# Altium project Med_Prj_ECG.PrjPcb (part 5 of 5)

## Sheet MCU.SchDoc
size A3; SheetNumber: 6; SheetTotal: 12
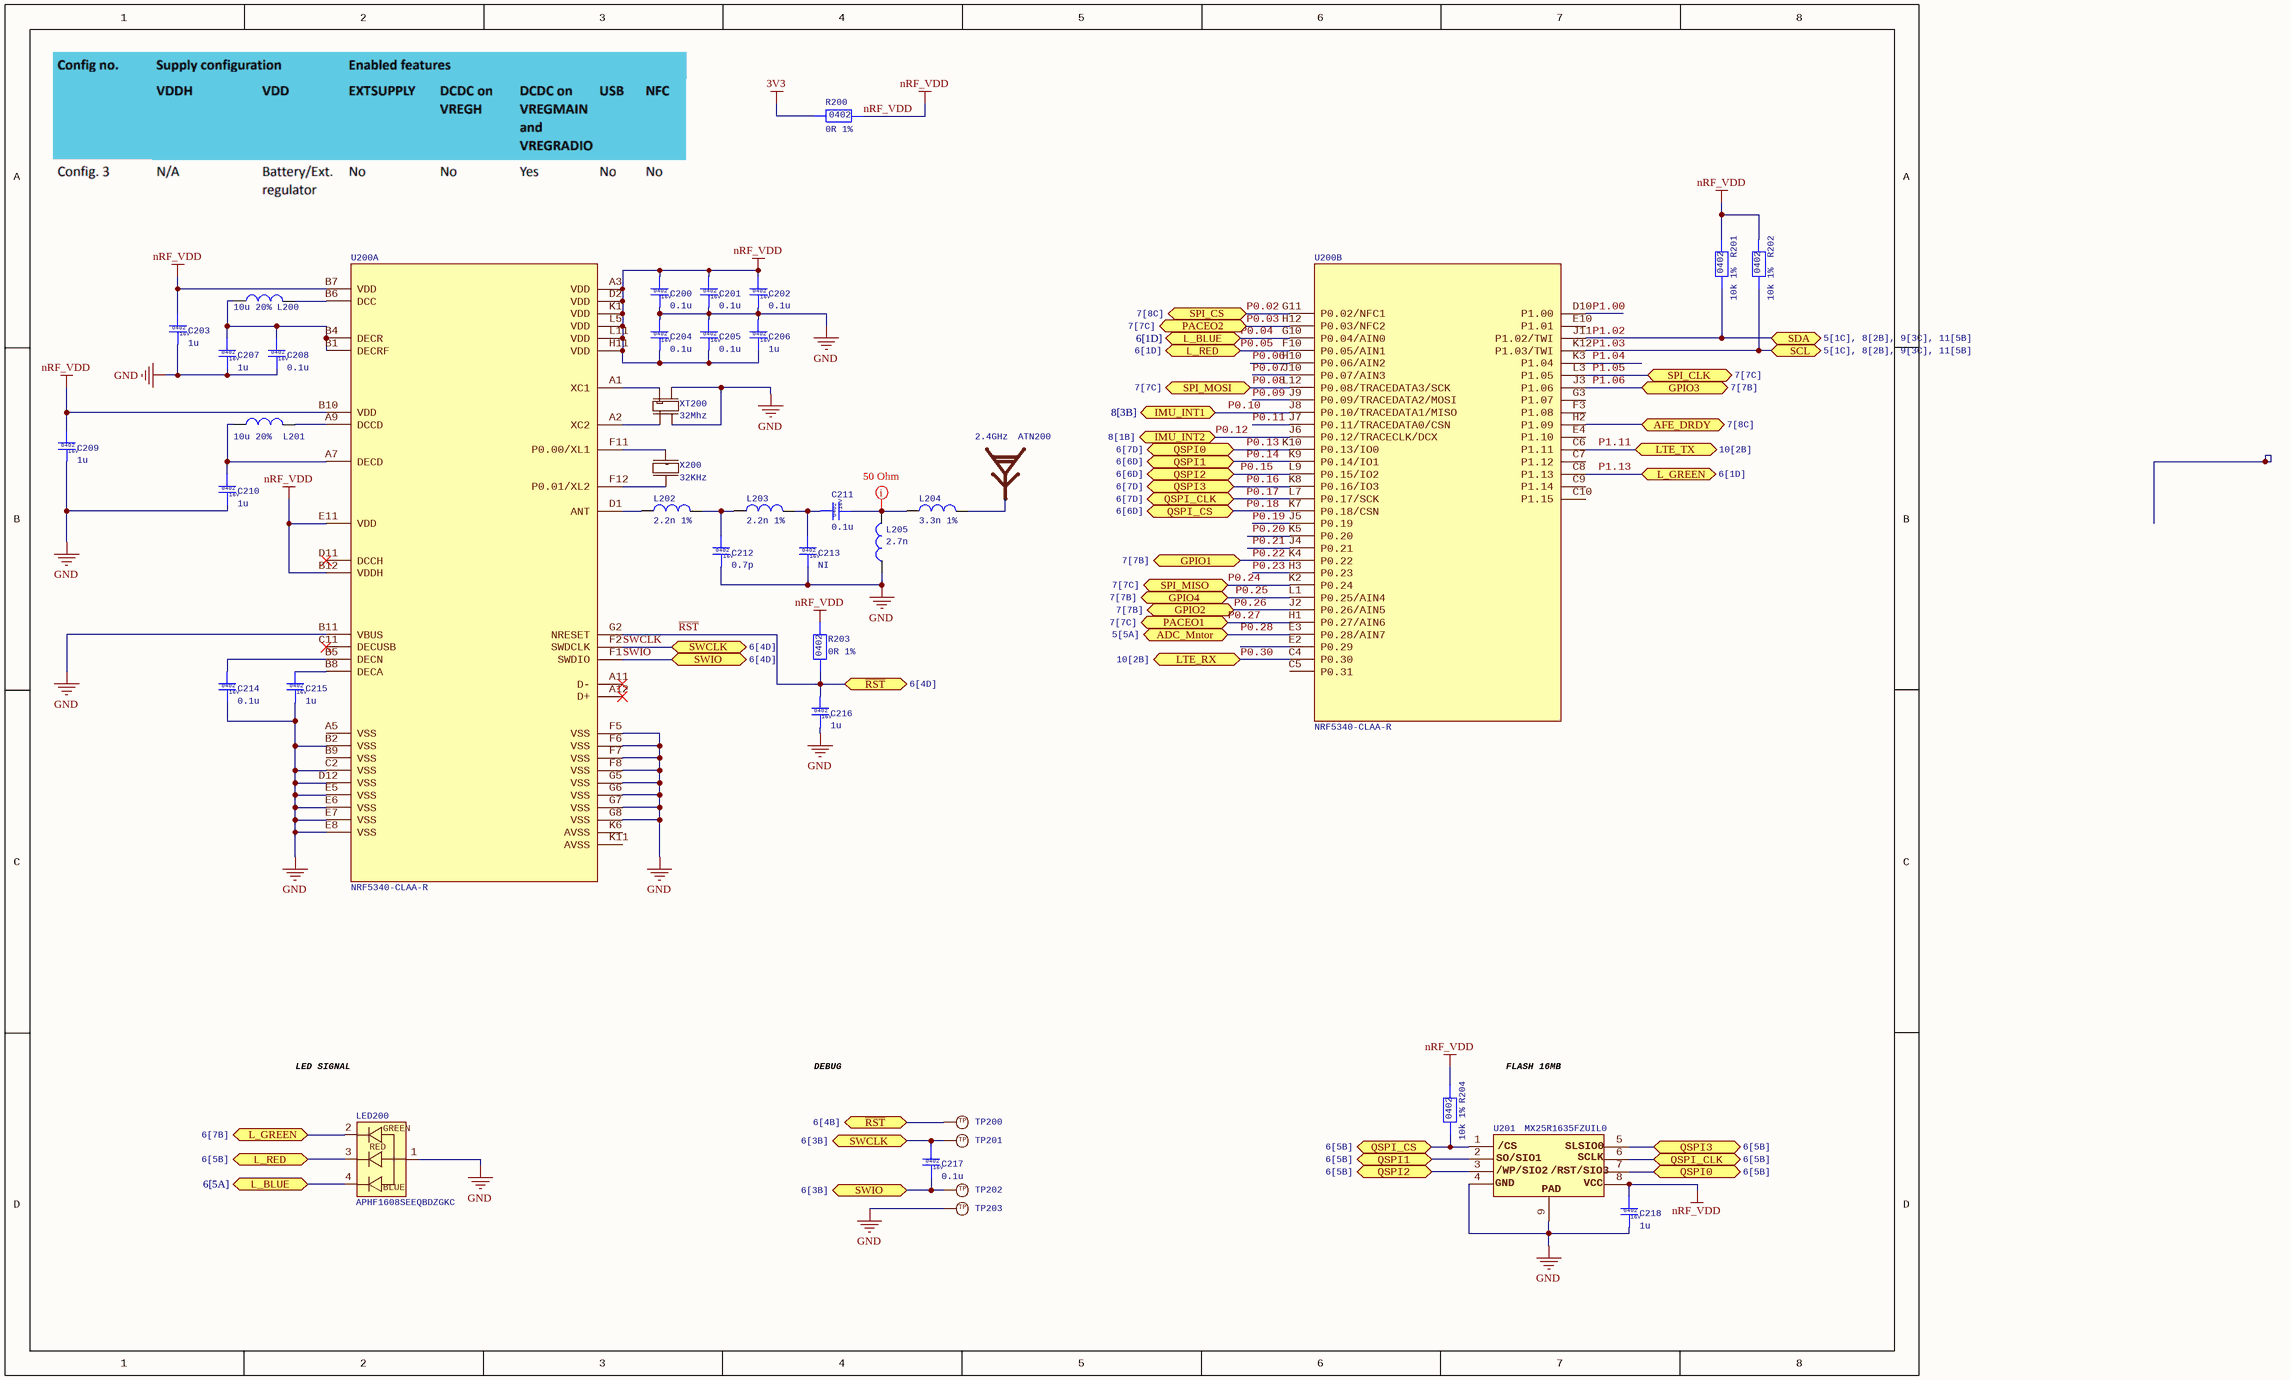
[diagram p8: MCU.SchDoc]

### Parts
ATN200  2.4GHz  [2450AT18B0100001E]
C200  0.1u  [CAP0402]
C201  0.1u  [CAP0402]
C202  0.1u  [CAP0402]
C203  1u  [CAP0402]
C204  0.1u  [CAP0402]
C205  0.1u  [CAP0402]
C206  1u  [CAP0402]
C207  1u  [CAP0402]
C208  0.1u  [CAP0402]
C209  1u  [CAP0402]
C210  1u  [CAP0402]
C211  0.1u  [CAP0402]
C212  0.7p  [CAP0402]
C213  NI  [CAP0402]
C214  0.1u  [CAP0402]
C215  1u  [CAP0402]
C216  1u  [CAP0402]
C217  0.1u  [CAP0402]
C218  1u  [CAP0402]
L200  10u 20%  [MLZ1608N100LTD25]
L201  10u 20%  [MLZ1608N100LTD25]
L202  2.2n 1%  [0402(1005) L]
L203  2.2n 1%  [0402(1005) L]
L204  3.3n 1%  [0402(1005) L]
L205  2.7n  [0402(1005) L]
LED200  APHF1608SEEQBDZGKC  [APHF1608SEEQBDZGKC]
R200  0R 1%  [RES0402]
R201  10k 1%  [R0402]
R202  10k 1%  [R0402]
R203  0R 1%  [RES0402]
R204  10k 1%  [R0402]
TP200  TP  [TP]  (value not drawn)
TP201  TP  [TP]  (value not drawn)
TP202  TP  [TP]  (value not drawn)
TP203  TP  [TP]  (value not drawn)
U200  NRF5340-CLAA-R  [NRF5340-CLAA-R]  (parts A,B of 2)
U201  MX25R1635FZUIL0  [MX25R1635FZUIL0]
X200  32KHz  [32Khz]
XT200  32Mhz  [XRCGB32M000F2P01R0]

### Ports
ADC_Mntor (bidir, see 5[5A]), AFE_DRDY (bidir, see 7[8C]), GPIO1 (bidir, see 7[7B]), GPIO2 (bidir, see 7[7B]), GPIO3 (bidir, see 7[7B]), GPIO4 (bidir, see 7[7B]), IMU_INT1 (bidir, see 8[3B]), IMU_INT2 (bidir, see 8[1B]), L_BLUE (bidir, see 6[1D]), L_BLUE (bidir, see 6[5A]), L_GREEN (bidir, see 6[1D]), L_GREEN (bidir, see 6[7B]), L_RED (bidir, see 6[1D]), L_RED (bidir, see 6[5B]), LTE_RX (bidir, see 10[2B]), LTE_TX (bidir, see 10[2B]), PACEO1 (bidir, see 7[7C]), PACEO2 (bidir, see 7[7C]), QSPI0 (bidir, see 6[5B]), QSPI0 (bidir, see 6[7D]), QSPI1 (bidir, see 6[5B]), QSPI1 (bidir, see 6[6D]), QSPI2 (bidir, see 6[5B]), QSPI2 (bidir, see 6[6D]), QSPI3 (bidir, see 6[5B]), QSPI3 (bidir, see 6[7D]), QSPI_CLK (bidir, see 6[5B]), QSPI_CLK (bidir, see 6[7D]), QSPI_CS (bidir, see 6[5B]), QSPI_CS (bidir, see 6[6D]), SCL (bidir, see 5[1C], 8[2B], 9[3C], 11[5B]), SDA (bidir, see 5[1C], 8[2B], 9[3C], 11[5B]), SPI_CLK (bidir, see 7[7C]), SPI_CS (bidir, see 7[8C]), SPI_MISO (bidir, see 7[7C]), SPI_MOSI (bidir, see 7[7C]), SWCLK (bidir, see 6[3B]), SWCLK (bidir, see 6[4D]), SWIO (bidir, see 6[3B]), SWIO (bidir, see 6[4D]), ~{RST} (bidir, see 6[4B]), ~{RST} (bidir, see 6[4D])

### Nets
3V3: R200.1
GND: C200.2 C201.2 C202.2 C203.2 C204.1 C205.1 C206.1 C207.2 C208.2 C209.2 C210.2 C212.2 C213.2 C214.2 C215.2 C216.2 C218.2 L205.1 LED200.1 TP203.1 U200.B2(VSS) U200.B11(VBUS) U200.C2(VSS) U200.D12(VSS) U200.E5(VSS) U200.E6(VSS) U200.E7(VSS) U200.E8(VSS) U200.F5(VSS) U200.F6(VSS) U200.F7(VSS) U200.F8(VSS) U200.G5(VSS) U200.G6(VSS) U200.G7(VSS) U200.G8(VSS) U201.4 U201.9 XT200.2 XT200.4
nRF_VDD: C200.1 C201.1 C202.1 C203.1 C204.2 C205.2 C206.2 C209.1 C218.1 R200.2 R201.2 R202.2 R203.2 R204.2 U200.A3(VDD) U200.B7(VDD) U200.B10(VDD) U200.B12(VDDH) U200.D2(VDD) U200.E11(VDD) U200.H11(VDD) U200.K1(VDD) U200.L5(VDD) U200.L11(VDD) U201.8
P0.02: U200.G11(P0.02/NFC1) ; port SPI_CS
P0.03: U200.H12(P0.03/NFC2) ; port PACEO2
P0.04: LED200.4 U200.G10(P0.04/AIN0) ; port L_BLUE
P0.05: LED200.3 U200.F10(P0.05/AIN1) ; port L_RED
P0.06: U200.H10(P0.06/AIN2)
P0.07: U200.J10(P0.07/AIN3)
P0.08: U200.L12(P0.08/TRACEDATA3/SCK) ; port SPI_MOSI
P0.09: U200.J9(P0.09/TRACEDATA2/MOSI)
P0.10: U200.J8(P0.10/TRACEDATA1/MISO) ; port IMU_INT1
P0.11: U200.J7(P0.11/TRACEDATA0/CSN)
P0.12: U200.J6(P0.12/TRACECLK/DCX) ; port IMU_INT2
P0.13: U200.K10(P0.13/IO0) U201.7 ; port QSPI0
P0.14: U200.K9(P0.14/IO1) U201.2(SO/SIO1) ; port QSPI1
P0.15: U200.L9(P0.15/IO2) U201.3 ; port QSPI2
P0.16: U200.K8(P0.16/IO3) U201.5 ; port QSPI3
P0.17: U200.L7(P0.17/SCK) U201.6 ; port QSPI_CLK
P0.18: R204.1 U200.K7(P0.18/CSN) U201.1(/CS) ; port QSPI_CS
P0.19: U200.J5(P0.19)
P0.20: U200.K5(P0.20)
P0.21: U200.J4(P0.21)
P0.22: U200.K4(P0.22) ; port GPIO1
P0.23: U200.H3(P0.23)
P0.24: U200.K2(P0.24) ; port SPI_MISO
P0.25: U200.L1(P0.25/AIN4) ; port GPIO4
P0.26: U200.J2(P0.26/AIN5) ; port GPIO2
P0.27: U200.H1(P0.27/AIN6) ; port PACEO1
P0.28: U200.E3(P0.28/AIN7) ; port ADC_Mntor
P0.30: U200.C4(P0.30) ; port LTE_RX  [project net LTE_RX]
P1.00: U200.D10(P1.00)
P1.02: R201.1 U200.J11(P1.02/TWI) ; port SDA
P1.03: R202.1 U200.K12(P1.03/TWI) ; port SCL
P1.04: U200.K3(P1.04)
P1.05: U200.L3(P1.05) ; port SPI_CLK
P1.06: U200.J3(P1.06) ; port GPIO3
P1.11: U200.C6(P1.11) ; port LTE_TX  [project net LTE_TX]
P1.13: LED200.2 U200.C8(P1.13) ; port L_GREEN
~{RST}: C216.1 R203.1 TP200.1 U200.G2(NRESET) ; port ~{RST}
SWCLK: C217.1 TP201.1 U200.F2(SWDCLK) ; port SWCLK
SWIO: C217.2 TP202.1 U200.F1(SWDIO) ; port SWIO
NetATN200_1: ATN200.1 L204.2
NetC207_1: C207.1 C208.1 L200.1 U200.B1(DECRF) U200.B4(DECR)
NetC210_1: C210.1 L201.1 U200.A7(DECD)
NetC211_1: C211.1 C213.1 L203.2
NetC211_2: C211.2 L204.1 L205.2
NetC212_1: C212.1 L202.2 L203.1
NetC214_1: C214.1 U200.B5(DECN)
NetC215_1: C215.1 U200.B8(DECA)
NetL200_2: L200.2 U200.B6(DCC)
NetL201_2: L201.2 U200.A9(DCCD)
NetL202_1: L202.1 U200.D1(ANT)
NetR313_1: U200.H2(P1.09) ; port AFE_DRDY
NetU200_A1: U200.A1(XC1) XT200.1
NetU200_A2: U200.A2(XC2) XT200.3
NetU200_F11: U200.F11(P0.00/XL1) X200.1
NetU200_F12: U200.F12(P0.01/XL2) X200.2

Not connected (* = marked no-connect by the designer): U200 A5(VSS) A11(D-)* A12(D+)* B9(VSS) C5(P0.31) C7(P1.12) C9(P1.14) C10(P1.15) C11(DECUSB)* D11(DCCH)* E2(P0.29) E4(P1.10) E10(P1.01) F3(P1.08) G3(P1.07) K6(AVSS) K11(AVSS)

### Layout directives
mark named 50 Ohm: NetC211_2

### Notes on the sheet
- LED SIGNAL
- DEBUG
- FLASH 16MB
- (in symbol APHF1608SEEQBDZGKC) GREEN; RED; BLUE
- (in symbol C_0402_0.7p) 16V
- (in symbol MX25R1635FZUIL0) SLSIO0; SCLK; /WP/SIO2; /RST/SIO3; GND; VCC; PAD

### Library data of the parts
ATN200 = 2450AT18B0100001E: Rf Ant 2.4GHZ Chip Solder SMD; Manufacturer: Johanson; Supplier 1: Digikey; Supplier Part Number 1: 712-2450AT18B0100001ECT-ND; Supplier: Digikey; Supplier Part Number: 712-2450AT18B0100001ECT-ND; Manufacturer Part Number: 2450AT18B0100001E; RoHS: No; Category: RF Antennas; Stock: 16167; Pricing: 1=1.02, 10=0.637, 25=0.534, 100=0.4175, 250=0.36032, 500=0.32526, 1000=0.29604 (USD)
C200-C202 C204 C205 C208 C211 C213 C214 C217 = C_0402_0.1u: Ceramic Capacitor, Multilayer, Ceramic, 16V, 10% +Tol, 10% -Tol, X7R, 15% TC, 0.1uF, Surface Mount, 0402; Manufacturer: Murata; Manufacturer Part Number: GRM155R71C104KA88J; Value: 100nF; Multilayer: Yes; Supplier: Digikey; Supplier Part Number: 490-6328-1-ND; RoHS: Yes; Category: Ceramic Capacitors; Stock: 19409569; Pricing: 1=0.1, 10=0.019, 50=0.011, 100=0.0086, 500=0.00646, 1000=0.00508, 2500=0.00462, 5000=0.00425 (USD); Mounting Technology: Surface Mount; Pins: 2; Dielectric Material: Ceramic; Package Shape: Rectangular; Case/Package: 0402; Terminal Finish: Nickel; Min Operating Temperature: -55°C; Max Operating Temperature: 125°C; JESD-609 Code: e3; Capacitor Type: Ceramic; Tolerance  (fill in as +-): 10%; Package Style: SMTMeter; Packaging: Tape and Reel; Tolerance (fill in as +-): 10%; Rated DC Voltage (URdc): 16V; Temperature Characteristics Code: X7R; Termination: Wraparound; Length: 1mm; Width: 0.5mm; Height: 0.5mm; Reach SVHC Compliant: Yes; RoHS Compliant: Yes; ComponentLink1URL: https://psearch.en.murata.com:443/capacitor/product/GRM155R71C104KA88%23.pdf?src-supplier=IHS+Markit; ComponentLink1Description: https://psearch.en.murata.com:443/capacitor/product/GRM155R71C104KA88%23.pdf?src-supplier=IHS+Markit; ComponentLink2URL: https://datasheet.ciiva.com/6271/product-6271168.pdf?src-supplier=Digikey; ComponentLink2Description: https://datasheet.ciiva.com/6271/product-6271168.pdf?src-supplier=Digikey; ComponentLink3URL: https://datasheet.ciiva.com/6271/grm155r71c104ka88-01-6271231.pdf?src-supplier=Digikey; ComponentLink3Description: https://datasheet.ciiva.com/6271/grm155r71c104ka88-01-6271231.pdf?src-supplier=Digikey
C203 C206 C207 C209 C210 C215 C216 C218 = C_0402_1u: Ceramic Capacitor, Multilayer, Ceramic, 16V, 10% +Tol, 10% -Tol, X5R, 15% TC, 1uF, Surface Mount, 0402; Manufacturer: Taiyo Yuden; Manufacturer Part Number: EMK105BJ105KV-F; Multilayer: Yes; Supplier: Digikey; Supplier Part Number: 587-2477-1-ND; RoHS: Yes; Category: Ceramic Capacitors; Stock: 2709915; Pricing: 1=0.1, 10=0.045, 50=0.031, 100=0.0266, 500=0.01912, 1000=0.01682, 2500=0.01437, 5000=0.01289 (USD); Mounting Technology: Surface Mount; Pins: 2; Dielectric Material: Ceramic; Package Shape: Rectangular; Case/Package: 0402; Terminal Finish: Nickel; Min Operating Temperature: -55°C; Max Operating Temperature: 85°C; JESD-609 Code: e3; Value: 1uF; Capacitor Type: Ceramic; Tolerance  (fill in as +-): 10%; Package Style: SMTMeter; Packaging: Tape and Reel; Tolerance (fill in as +-): 10%; Rated DC Voltage (URdc): 16V; Temperature Characteristics Code: X5R; Termination: Wraparound; Length: 1mm; Width: 0.5mm; Height: 0.5mm; Reach SVHC Compliant: Yes; RoHS Compliant: Yes; ComponentLink1URL: https://datasheet.ciiva.com:443/pdfs/VipMasterIC/IC/TAIY/TAIY-S-A0009096450/TAIY-S-A0009096597-1.pdf?src-supplier=IHS+Markit; ComponentLink1Description: https://datasheet.ciiva.com:443/pdfs/VipMasterIC/IC/TAIY/TAIY-S-A0009096450/TAIY-S-A0009096597-1.pdf?src-supplier=IHS+Markit; ComponentLink2URL: https://datasheet.ciiva.com/134/emk105bj105kv-f-ss-134209.pdf?src-supplier=Digikey; ComponentLink2Description: https://datasheet.ciiva.com/134/emk105bj105kv-f-ss-134209.pdf?src-supplier=Digikey; ComponentLink3URL: https://datasheet.ciiva.com/15920/964emk105bj105kv-f-15920402.pdf?src-supplier=Onlinecomponents.com; ComponentLink3Description: https://datasheet.ciiva.com/15920/964emk105bj105kv-f-15920402.pdf?src-supplier=Onlinecomponents.com; ComponentLink4URL: https://datasheet.ciiva.com/26871/getdatasheetpartid-638287-26871289.pdf?src-supplier=Verical; ComponentLink4Description: https://datasheet.ciiva.com/26871/getdatasheetpartid-638287-26871289.pdf?src-supplier=Verical; ComponentLink5URL: https://datasheet.ciiva.com/30259/265emk105bj105kv-f-30259872.pdf?src-supplier=Onlinecomponents.com; ComponentLink5Description: https://datasheet.ciiva.com/30259/265emk105bj105kv-f-30259872.pdf?src-supplier=Onlinecomponents.com; ComponentLink6URL: https://datasheet.ciiva.com/7657/1497285-7657320.pdf?src-supplier=Element14; ComponentLink6Description: https://datasheet.ciiva.com/7657/1497285-7657320.pdf?src-supplier=Element14; ComponentLink7URL: https://datasheet.ciiva.com/22694/1497285-22694239.pdf?src-supplier=Element14; ComponentLink7Description: https://datasheet.ciiva.com/22694/1497285-22694239.pdf?src-supplier=Element14; ComponentLink8URL: https://datasheet.ciiva.com/5424/mlcc01-e-5424190.pdf?src-supplier=Mouser; ComponentLink8Description: https://datasheet.ciiva.com/5424/mlcc01-e-5424190.pdf?src-supplier=Mouser
C212 = C_0402_0.7p: Ceramic Capacitor, Multilayer, Ceramic, 50V, 7.14% +Tol, 7.14% -Tol, C0G, 30ppm/Cel TC, 0.0000007uF, Surface Mount, 0402; Manufacturer: Murata; Manufacturer Part Number: GJM1555C1HR70WB01D; Value: 0.7pF; Multilayer: Yes; Supplier: Digikey; Supplier Part Number: 490-11252-1-ND; RoHS: Yes; Category: Ceramic Capacitors; Stock: 178737; Pricing: 1=0.18, 10=0.122, 50=0.073, 100=0.0574, 500=0.04242, 1000=0.03511, 2500=0.03268, 5000=0.0299 (USD); Mounting Technology: Surface Mount; Pins: 2; Dielectric Material: Ceramic; Package Shape: Rectangular; Case/Package: 0402; Terminal Finish: Nickel; Min Operating Temperature: -55°C; Max Operating Temperature: 125°C; JESD-609 Code: e3; Capacitor Type: Ceramic; Tolerance  (fill in as +-): 7.14%; Package Style: SMTMeter; Packaging: Tape and Reel; Tolerance (fill in as +-): 7.14%; Rated DC Voltage (URdc): 50V; Temperature Characteristics Code: C0G; Termination: Wraparound; Length: 1mm; Width: 0.5mm; Height: 0.5mm; Reach SVHC Compliant: Yes; RoHS Compliant: Yes; ComponentLink1URL: https://datasheet.ciiva.com:443/pdfs/VipMasterIC/IC/MURE/MURE-S-A0004378008/MURE-S-A0004383522-1.pdf?src-supplier=IHS+Markit; ComponentLink1Description: https://datasheet.ciiva.com:443/pdfs/VipMasterIC/IC/MURE/MURE-S-A0004378008/MURE-S-A0004383522-1.pdf?src-supplier=IHS+Markit; ComponentLink2URL: https://datasheet.ciiva.com/170/product-170099.pdf?src-supplier=Digikey; ComponentLink2Description: https://datasheet.ciiva.com/170/product-170099.pdf?src-supplier=Digikey; ComponentLink3URL: https://datasheet.ciiva.com/2989/product-2989256.pdf?src-supplier=Avnet; ComponentLink3Description: https://datasheet.ciiva.com/2989/product-2989256.pdf?src-supplier=Avnet
L200 L201 = Inductor 10u: General Purpose Inductor, 10uH, 20%, 1 Element, Ferrite-Core, SMD, 0603; Manufacturer: TDK; Supplier 1: Digikey; Supplier Part Number 1: 445-17067-1-ND; Supplier: Digikey; Supplier Part Number: 445-17067-1-ND; Manufacturer Part Number: MLZ1608N100LTD25; RoHS: Yes; Category: Fixed Inductors; Stock: 21104; Pricing: 1=0.18, 10=0.149, 25=0.1364, 50=0.1206, 100=0.1054, 250=0.10044, 500=0.0944, 1000=0.07231 (USD); Inductor Type: GENERAL PURPOSE INDUCTOR; Reach SVHC Compliant: Yes; RoHS Compliant: Yes; ComponentLink1URL: https://datasheet.ciiva.com:443/pdfs/VipMasterIC/IC/TDKC/TDKC-S-A0007713921/TDKC-S-A0007713921-1.pdf?src-supplier=IHS+Markit; ComponentLink1Description: https://datasheet.ciiva.com:443/pdfs/VipMasterIC/IC/TDKC/TDKC-S-A0007713921/TDKC-S-A0007713921-1.pdf?src-supplier=IHS+Markit; ComponentLink2URL: http://www.mouser.com/ds/2/400/nductor_commercial_decoupling_mlz1608_en-837720.pdf?src-supplier=Mouser; ComponentLink2Description: http://www.mouser.com/ds/2/400/nductor_commercial_decoupling_mlz1608_en-837720.pdf?src-supplier=Mouser; ComponentLink3URL: https://product.tdk.com/info/en/catalog/datasheets/inductor_automotive_decoupling_mlz1608_en.pdf?src-supplier=Digikey; ComponentLink3Description: https://product.tdk.com/info/en/catalog/datasheets/inductor_automotive_decoupling_mlz1608_en.pdf?src-supplier=Digikey; ComponentLink4URL: https://product.tdk.com/info/en/catalog/datasheets/inductor_automotive_decoupling_mlz1608_en.pdf?ref_disty=digikey&src-supplier=Digikey; ComponentLink4Description: https://product.tdk.com/info/en/catalog/datasheets/inductor_automotive_decoupling_mlz1608_en.pdf?ref_disty=digikey&src-supplier=Digikey; ComponentLink5URL: https://datasheet.octopart.com/MLZ1608N100LTD25-TDK-datasheet-66132923.pdf?src-supplier=Future+Electronics; ComponentLink5Description: https://datasheet.octopart.com/MLZ1608N100LTD25-TDK-datasheet-66132923.pdf?src-supplier=Future+Electronics; Value: 10uH
L202 L203 = Inductor 2.2n: General Purpose Inductor, 0.0022uH, 4.545%, 1 Element, SMD, 0402; Manufacturer: Murata; Manufacturer Part Number: LQG15HS2N2B02D; DC Resistance (DCR): 90mR; Inductor Application: RF INDUCTOR; Channels: 1; Quality Factor-Min (at L-nom): 8; Max Current Rating: 900mA; Self Resonant Frequency: 6GHz; Shape/Size Description: RECTANGULAR PACKAGE; Shielding: Unshielded; Test Frequency: 100MHz; Supplier: Digikey; Supplier Part Number: 490-LQG15HS2N2B02DCT-ND; RoHS: Yes; Category: Fixed Inductors; Stock: 10334; Pricing: 1=0.1, 10=0.064, 25=0.058, 50=0.0538, 100=0.0498, 250=0.04508, 500=0.04178, 1000=0.03871, 2500=0.035 (USD); Pins: 2; Terminal Finish: Tin; Min Operating Temperature: -55°C; Max Operating Temperature: 125°C; Tolerance: 4.545%; JESD-609 Code: e3; Inductance-Nom (L): 0.0022uH; Inductor Type: GENERAL PURPOSE INDUCTOR; Surface Mount: Yes; Terminal Placement: Dual Ended; Termination: Wraparound; Reach SVHC Compliant: Yes; RoHS Compliant: Yes; ComponentLink1URL: https://psearch.en.murata.com:443/inductor/product/LQG15HS2N2B02_.pdf?src-supplier=IHS+Markit; ComponentLink1Description: https://psearch.en.murata.com:443/inductor/product/LQG15HS2N2B02_.pdf?src-supplier=IHS+Markit
L204 = Inductor 3.3n: General Purpose Inductor, 0.0033uH, 9.091%, 1 Element, Air-Core, SMD, 0402; Manufacturer: Murata; Manufacturer Part Number: LQG15HS3N3S02D; Core Material: Air; Case/Size Code: 0402; DC Resistance (DCR): 125mR; Inductor Application: RF INDUCTOR; Channels: 1; Quality Factor-Min (at L-nom): 8; Max Current Rating: 800mA; Self Resonant Frequency: 6GHz; Shape/Size Description: RECTANGULAR PACKAGE; Shielding: Unshielded; Test Frequency: 100MHz; Package Height: 0.5mm; Package Length: 1mm; Supplier: Digikey; Supplier Part Number: 490-2616-1-ND; RoHS: Yes; Category: Fixed Inductors; Stock: 49001; Pricing: 1=0.1, 10=0.046, 25=0.042, 50=0.0388, 100=0.036, 250=0.03256, 500=0.03016, 1000=0.02795, 2500=0.02528 (USD); Pins: 2; Terminal Finish: Nickel; Min Operating Temperature: -55°C; Max Operating Temperature: 125°C; Tolerance: 9.091%; JESD-609 Code: e3; Construction: Multilayer Chip; Inductance-Nom (L): 0.0033uH; Inductor Type: GENERAL PURPOSE INDUCTOR; Package Style: SMTMeter; Packaging: Tape and Reel; Surface Mount: Yes; Terminal Placement: Dual Ended; Termination: Wraparound; Package Width: 0.5mm; Reach SVHC Compliant: Yes; RoHS Compliant: Yes; ComponentLink1URL: https://datasheet.ciiva.com:443/pdfs/VipMasterIC/IC/MURE/MURE-S-A0004278247/MURE-S-A0004278708-1.pdf?src-supplier=IHS+Markit; ComponentLink1Description: https://datasheet.ciiva.com:443/pdfs/VipMasterIC/IC/MURE/MURE-S-A0004278247/MURE-S-A0004278708-1.pdf?src-supplier=IHS+Markit; ComponentLink2URL: https://datasheet.ciiva.com/11799/0900766b8090d685-11799072.pdf?src-supplier=Rs; ComponentLink2Description: https://datasheet.ciiva.com/11799/0900766b8090d685-11799072.pdf?src-supplier=Rs; ComponentLink3URL: https://datasheet.ciiva.com/1038/l0075s0083lqg15hs-1038143.pdf?src-supplier=Digikey; ComponentLink3Description: https://datasheet.ciiva.com/1038/l0075s0083lqg15hs-1038143.pdf?src-supplier=Digikey; ComponentLink4URL: https://datasheet.ciiva.com/1038/l0075s0083lqg15hs-1038142.pdf?src-supplier=Digikey; ComponentLink4Description: https://datasheet.ciiva.com/1038/l0075s0083lqg15hs-1038142.pdf?src-supplier=Digikey; ComponentLink5URL: https://datasheet.ciiva.com/4976/o05e-4976661.pdf?src-supplier=Mouser; ComponentLink5Description: https://datasheet.ciiva.com/4976/o05e-4976661.pdf?src-supplier=Mouser; ComponentLink6URL: https://datasheet.ciiva.com/26821/getdatasheetpartid-200403-26821446.pdf?src-supplier=Verical; ComponentLink6Description: https://datasheet.ciiva.com/26821/getdatasheetpartid-200403-26821446.pdf?src-supplier=Verical; ComponentLink7URL: https://datasheet.ciiva.com/1038/l0075s0083lqg15hs-1038144.pdf?src-supplier=Digikey; ComponentLink7Description: https://datasheet.ciiva.com/1038/l0075s0083lqg15hs-1038144.pdf?src-supplier=Digikey
L205 = Inductor 2.7n: General Purpose Inductor, 0.0027uH, 11.111%, 1 Element, Air-Core, SMD, 0402; Manufacturer: Murata; Manufacturer Part Number: LQG15HS2N7S02D; Core Material: Air; Case/Size Code: 0402; DC Resistance (DCR): 120mR; Inductor Application: RF INDUCTOR; Channels: 1; Quality Factor-Min (at L-nom): 8; Max Current Rating: 800mA; Self Resonant Frequency: 6GHz; Shape/Size Description: RECTANGULAR PACKAGE; Shielding: Unshielded; Test Frequency: 100MHz; Package Height: 0.5mm; Package Length: 1mm; Supplier: Digikey; Supplier Part Number: 490-2615-1-ND; RoHS: Yes; Category: Fixed Inductors; Stock: 90500; Pricing: 1=0.1, 10=0.045, 25=0.0408, 50=0.0362, 100=0.0316, 250=0.03012, 500=0.02832, 1000=0.02169, 2500=0.02049 (USD); Pins: 2; Terminal Finish: Nickel; Min Operating Temperature: -55°C; Max Operating Temperature: 125°C; Tolerance: 11.111%; JESD-609 Code: e3; Termination: Wraparound; Construction: Multilayer Chip; Inductance-Nom (L): 0.0027uH; Inductor Type: GENERAL PURPOSE INDUCTOR; Package Style: SMTMeter; Packaging: Tape and Reel; Surface Mount: Yes; Terminal Placement: Dual Ended; Package Width: 0.5mm; RoHS Compliant: Yes; Reach SVHC Compliant: Yes; ComponentLink1URL: https://datasheet.ciiva.com:443/pdfs/VipMasterIC/IC/MURE/MURE-S-A0004224658/MURE-S-A0004278201-1.pdf?src-supplier=IHS+Markit; ComponentLink1Description: https://datasheet.ciiva.com:443/pdfs/VipMasterIC/IC/MURE/MURE-S-A0004224658/MURE-S-A0004278201-1.pdf?src-supplier=IHS+Markit; ComponentLink2URL: https://datasheet.ciiva.com/11801/0900766b8090d685-11801391.pdf?src-supplier=Rs; ComponentLink2Description: https://datasheet.ciiva.com/11801/0900766b8090d685-11801391.pdf?src-supplier=Rs; ComponentLink3URL: https://datasheet.ciiva.com/1038/l0075s0083lqg15hs-1038151.pdf?src-supplier=Digikey; ComponentLink3Description: https://datasheet.ciiva.com/1038/l0075s0083lqg15hs-1038151.pdf?src-supplier=Digikey; ComponentLink4URL: https://datasheet.ciiva.com/1038/l0075s0083lqg15hs-1038153.pdf?src-supplier=Digikey; ComponentLink4Description: https://datasheet.ciiva.com/1038/l0075s0083lqg15hs-1038153.pdf?src-supplier=Digikey; ComponentLink5URL: https://datasheet.ciiva.com/1038/l0075s0083lqg15hs-1038152.pdf?src-supplier=Digikey; ComponentLink5Description: https://datasheet.ciiva.com/1038/l0075s0083lqg15hs-1038152.pdf?src-supplier=Digikey
LED200 = APHF1608SEEQBDZGKC: Triple Color LED, Hyper Red/green/blue, Water Clear, 1.6mm; Manufacturer: Kingbright; Supplier 1: Digikey; Supplier Part Number 1: 754-2144-1-ND; Supplier 2: Digikey; Supplier Part Number 2: 754-2144-2-ND; Supplier: Mouser; Supplier Part Number: 604-APHF1608QBDZGKC; Manufacturer Part Number: APHF1608SEEQBDZGKC; RoHS: Yes; Category: LEDs; Stock: 1314; Pricing: 1=0.68, 10=0.444, 50=0.444, 100=0.291, 1000=0.221, 10000=0.209 (USD); Optoelectronic Device Type: TRIPLE COLOR LED; Reach SVHC Compliant: Yes; RoHS Compliant: Yes; ComponentLink1URL: https://datasheet.ciiva.com:443/pdfs/VipMasterIC/IC/KBEC/KBEC-S-A0008947180/KBEC-S-A0008953389-1.pdf?src-supplier=IHS+Markit; ComponentLink1Description: https://datasheet.ciiva.com:443/pdfs/VipMasterIC/IC/KBEC/KBEC-S-A0008947180/KBEC-S-A0008953389-1.pdf?src-supplier=IHS+Markit; ComponentLink2URL: http://www.kingbrightusa.com/images/catalog/SPEC/APHF1608SEEQBDZGKC.pdf?src-supplier=Digikey; ComponentLink2Description: http://www.kingbrightusa.com/images/catalog/SPEC/APHF1608SEEQBDZGKC.pdf?src-supplier=Digikey
R200 R203 = R_0402_0R: Metal Glaze/thick Film, 0.0625W, 0ohm, Surface Mount, 0402; Manufacturer: Yageo; Manufacturer Part Number: RC0402JR-070RL; Power: 62.5mW; Rated Temperature: 70°C; Package Height: 0.35mm; Package Length: 1mm; Package Width: 0.5mm; Supplier 1: Digikey; Supplier Part Number 1: 311-0.0JRTR-ND; Supplier: Digikey; Supplier Part Number: 311-0.0JRCT-ND; RoHS: Yes; Category: Chip SMD Resistors; Stock: 14877447; Pricing: 1=0.1, 10=0.011, 25=0.0084, 50=0.0064, 100=0.0045, 250=0.00364, 500=0.0029, 1000=0.00214, 5000=0.00154, 10000=0.00133, 30000=0.00117, 50000=0.00107, 100000=0.00105 (USD); Mounting Technology: Surface Mount; Pins: 2; Package Shape: Rectangular; Case/Package: 0402; Terminal Finish: Nickel; Min Operating Temperature: -55°C; Max Operating Temperature: 155°C; JESD-609 Code: e3; Resistor Type: FIXED RESISTOR; Packaging: Tape and Reel; Value: 0R; Technology: METAL GLAZE/THICK FILM; Termination: Wraparound; Construction: Chip; Package Style: SMTMeter; Reach SVHC Compliant: Yes; RoHS Compliant: Yes; ComponentLink1URL: https://datasheet.ciiva.com:443/pdfs/VipMasterIC/IC/YAGO/YAGO-S-A0008145938/YAGO-S-A0008145938-1.pdf?src-supplier=IHS+Markit; ComponentLink1Description: https://datasheet.ciiva.com:443/pdfs/VipMasterIC/IC/YAGO/YAGO-S-A0008145938/YAGO-S-A0008145938-1.pdf?src-supplier=IHS+Markit; ComponentLink2URL: https://datasheet.ciiva.com/2452/pyu-rc0402-51-rohs-l-6-2452608.pdf?src-supplier=Digikey; ComponentLink2Description: https://datasheet.ciiva.com/2452/pyu-rc0402-51-rohs-l-6-2452608.pdf?src-supplier=Digikey; ComponentLink3URL: https://datasheet.ciiva.com/11808/0900766b80c66297-11808195.pdf?src-supplier=Rs; ComponentLink3Description: https://datasheet.ciiva.com/11808/0900766b80c66297-11808195.pdf?src-supplier=Rs; ComponentLink4URL: https://datasheet.ciiva.com/7983/1018594-7983535.pdf?src-supplier=Element14; ComponentLink4Description: https://datasheet.ciiva.com/7983/1018594-7983535.pdf?src-supplier=Element14; ComponentLink5URL: https://datasheet.ciiva.com/22747/1018594-22747515.pdf?src-supplier=Element14; ComponentLink5Description: https://datasheet.ciiva.com/22747/1018594-22747515.pdf?src-supplier=Element14; ComponentLink6URL: https://datasheet.ciiva.com/2452/pyu-r-int-thick-7-2452609.pdf?src-supplier=Digikey; ComponentLink6Description: https://datasheet.ciiva.com/2452/pyu-r-int-thick-7-2452609.pdf?src-supplier=Digikey; ComponentLink7URL: https://datasheet.ciiva.com/2452/pyu-r-int-thick-7-2452610.pdf?src-supplier=Digikey; ComponentLink7Description: https://datasheet.ciiva.com/2452/pyu-r-int-thick-7-2452610.pdf?src-supplier=Digikey; ComponentLink8URL: https://datasheet.ciiva.com/8896/pyu-rc0402-51-rohs-l-6-8896201.pdf?src-supplier=Avnet; ComponentLink8Description: https://datasheet.ciiva.com/8896/pyu-rc0402-51-rohs-l-6-8896201.pdf?src-supplier=Avnet
R201 R202 R204 = R_0402_10k: Fixed Resistor, Metal Glaze/thick Film, 0.06W, 10000ohm, 50V, 1% +/-Tol, 100ppm/Cel, Surface Mount, 0402; Manufacturer: Samsung; Manufacturer Part Number: RC1005F103CS; Power: 60mW; Value: 10kR; Temperature Coefficient: 100ppm/°C; Package Height: 0.35mm; Package Length: 1mm; Package Width: 0.5mm; Supplier: Digikey; Supplier Part Number: 1276-3431-1-ND; RoHS: Yes; Category: Chip SMD Resistors; Stock: 14343795; Pricing: 1=0.1, 10=0.024, 50=0.0156, 100=0.0132, 500=0.00922, 1000=0.00803, 5000=0.00598, 10000=0.00533, 20000=0.00481, 30000=0.00458 (USD); Mounting Technology: Surface Mount; Pins: 2; Package Shape: Rectangular; Case/Package: 0402; Terminal Finish: Nickel; Min Operating Temperature: -55°C; Max Operating Temperature: 125°C; Tolerance: 1%; JESD-609 Code: e3; Resistor Type: FIXED RESISTOR; Construction: Chip; Package Style: SMTMeter; Packaging: Tape and Reel; Technology: METAL GLAZE/THICK FILM; Working Voltage: 50V; Reach SVHC Compliant: Yes; RoHS Compliant: Yes; ComponentLink1URL: https://datasheet.ciiva.com:443/pdfs/VipMasterIC/IC/SEMS/SEMS-S-A0001326806/SEMS-S-A0001326806-1.pdf?src-supplier=IHS+Markit; ComponentLink1Description: https://datasheet.ciiva.com:443/pdfs/VipMasterIC/IC/SEMS/SEMS-S-A0001326806/SEMS-S-A0001326806-1.pdf?src-supplier=IHS+Markit; ComponentLink2URL: https://datasheet.ciiva.com/15196/getdatasheetpartid-504789-15196214.pdf?src-supplier=Verical; ComponentLink2Description: https://datasheet.ciiva.com/15196/getdatasheetpartid-504789-15196214.pdf?src-supplier=Verical; ComponentLink3URL: https://datasheet.ciiva.com/16481/rcseries-16481007.pdf?src-supplier=Future+Electronics; ComponentLink3Description: https://datasheet.ciiva.com/16481/rcseries-16481007.pdf?src-supplier=Future+Electronics
TP200-TP203 = TP: Test Point
U200 = NRF5340-CLAA-R: IC RF TXRX+MCU 802.15.4 95WLCSP; Manufacturer: Nordic Semiconductor; Supplier 1: Digikey; Supplier Part Number 1: 4823-NRF5340-CLAA-RCT-ND; Supplier: Digikey; Supplier Part Number: 4823-NRF5340-CLAA-RCT-ND; Manufacturer Part Number: NRF5340-CLAA-R; RoHS: No; Category: RF Receivers, Transceivers; Stock: 15499; Pricing: 1=7.28, 100=6.2, 500=5.39004, 1000=4.93002 (USD)
U201 = MX25R1635FZUIL0: Flash, 4MX4, PDSO8; Manufacturer: Macronix; Package Body Material: Plastic; Channels: 1; Alternate Memory Width: 2; Clock Frequency: 80MHz; Density: 16777216b; Memory Width: 4; Memory Size: 4194304; Number of Words Code: 4M; Operating Mode: SYNCHRONOUS; Parallel/Serial: SERIAL; Programming Voltage: 3V; Max Supply Voltage: 3.6V; Min Supply Voltage: 1.65V; Nominal Supply Voltage: 1.8V; Supplier 1: Digikey; Supplier Part Number 1: 1092-1204-1-ND; Supplier: Digikey; Supplier Part Number: 1092-1204-1-ND; Manufacturer Part Number: MX25R1635FZUIL0; RoHS: Yes; Category: Memory; Stock: 57667; Pricing: 1=0.97, 10=0.858, 25=0.8184, 50=0.7898, 100=0.7621, 250=0.72684, 500=0.70126, 1000=0.67654, 5000=0.62231, 12000=0.59458 (USD); Case/Package: HVSON; Pins: 8; Package Shape: Rectangular; Min Operating Temperature: -40°C; Max Operating Temperature: 85°C; Memory Format: FLASH; JESD-30 Code: R-PDSO-N8; Organization: 4MX4; Package Style: SMALL OUTLINE, HEAT SINK/SLUG, VERY THIN PROFILEMeter; Surface Mount: Yes; Technology: CMOS; Terminal Form: No Lead; Terminal Position: DUAL; Length: 3mm; Width: 2mm; Terminal Pitch: 0.5mm; Height - Seated (Max): 0.6mm; RoHS Compliant: Yes; Reach SVHC Compliant: Yes; Temperature Grade: INDUSTRIAL; ComponentLink1URL: https://datasheet.ciiva.com:443/pdfs/VipMasterIC/IC/MXMA/MXMA-S-A0007136734/MXMA-S-A0007136734-1.pdf?src-supplier=IHS+Markit; ComponentLink1Description: https://datasheet.ciiva.com:443/pdfs/VipMasterIC/IC/MXMA/MXMA-S-A0007136734/MXMA-S-A0007136734-1.pdf?src-supplier=IHS+Markit; ComponentLink2URL: http://ckassoc.com/oldsite/pdf/Macronix_Product_Line_Card_July_2017_General%20_070617.pdf?src-supplier=Digikey; ComponentLink2Description: http://ckassoc.com/oldsite/pdf/Macronix_Product_Line_Card_July_2017_General%20_070617.pdf?src-supplier=Digikey; ComponentLink3URL: https://datasheet.octopart.com/MX25R1635FZUIL0-Macronix-datasheet-74389714.pdf?src-supplier=SHENGYU+ELECTRONICS; ComponentLink3Description: https://datasheet.octopart.com/MX25R1635FZUIL0-Macronix-datasheet-74389714.pdf?src-supplier=SHENGYU+ELECTRONICS
X200 = CM8V-T1A-32.768KHZ-12.5PF-20PPM-TA-QA: CRYSTAL 32.7680KHZ 12.5PF SMD; Manufacturer: Micro Crystal; Supplier: Digikey; Supplier Part Number: 2195-CM8V-T1A-32.768KHZ-12.5PF-20PPM-TA-QACT-ND; Manufacturer Part Number: CM8V-T1A-32.768KHZ-12.5PF-20PPM-TA-QA; RoHS: No; Category: LDO; Stock: 22759; Pricing: 1=0.43, 10=0.366, 50=0.33, 100=0.3156, 500=0.28466 (USD); Supplier 1: Digikey; Supplier Part Number 1: 2195-CM8V-T1A-32.768KHZ-12.5PF-20PPM-TA-QACT-ND
XT200 = XRCGB32M000F2P01R0: Parallel - Fundamental Quartz Crystal, 32MHz Nom; Manufacturer: Murata; Supplier 1: Digikey; Supplier Part Number 1: 490-18340-1-ND; Supplier: Digikey; Supplier Part Number: 490-18340-1-ND; Manufacturer Part Number: XRCGB32M000F2P01R0; RoHS: Yes; Category: Crystals; Stock: 3681354; Pricing: 1=0.23, 10=0.189, 50=0.1696, 100=0.1508, 500=0.14326, 1000=0.13275 (USD); Crystal/Resonator Type: PARALLEL - FUNDAMENTAL; Reach SVHC Compliant: Yes; RoHS Compliant: Yes; ComponentLink1URL: https://datasheet.ciiva.com:443/pdfs/VipMasterIC/IC/MURE/MURE-S-A0006740795/MURE-S-A0006740847-1.pdf?src-supplier=IHS+Markit; ComponentLink1Description: https://datasheet.ciiva.com:443/pdfs/VipMasterIC/IC/MURE/MURE-S-A0006740795/MURE-S-A0006740847-1.pdf?src-supplier=IHS+Markit

## Sheet POWER_TREE.SchDoc
size A4; SheetNumber: 4; SheetTotal: 12
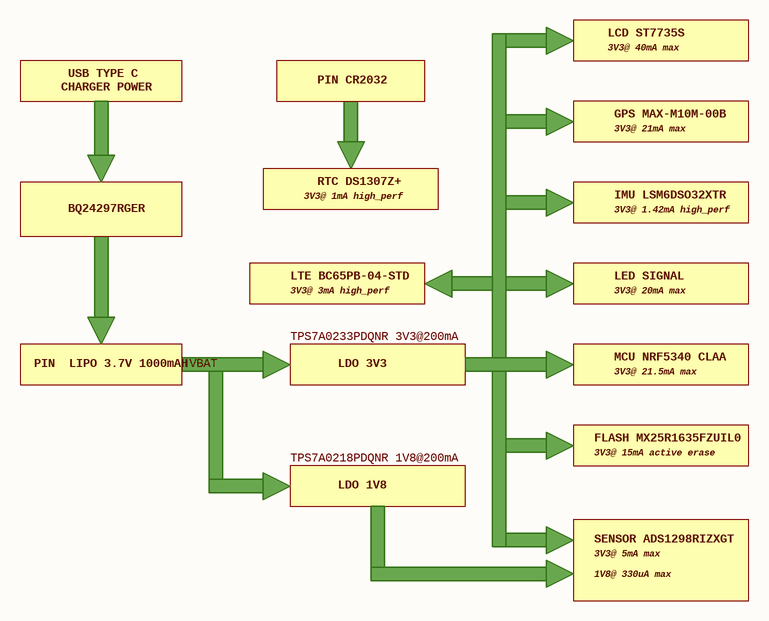
[diagram p9: POWER_TREE.SchDoc]

### Notes on the sheet
- LCD ST7735S
- 3V3@ 40mA max
- CHARGER POWER
- USB TYPE C
- PIN CR2032
- RTC DS1307Z+
- GPS MAX-M10M-00B
- 3V3@ 21mA max
- BQ24297RGER
- 3V3@ 1mA high_perf
- IMU LSM6DSO32XTR
- 3V3@ 1.42mA high_perf
- LTE BC65PB-04-STD
- 3V3@ 3mA high_perf
- LED SIGNAL
- 3V3@ 20mA max
- PIN  LIPO 3.7V 1000mAH
- VBAT
- TPS7A0233PDQNR 3V3@200mA
- LDO 3V3
- MCU NRF5340 CLAA
- 3V3@ 21.5mA max
- FLASH MX25R1635FZUIL0
- 3V3@ 15mA active erase
- TPS7A0218PDQNR 1V8@200mA
- LDO 1V8
- SENSOR ADS1298RIZXGT
- 3V3@ 5mA max
- 1V8@ 330uA max

## Sheet GSM.SchDoc
size A; SheetNumber: 10; SheetTotal: 12
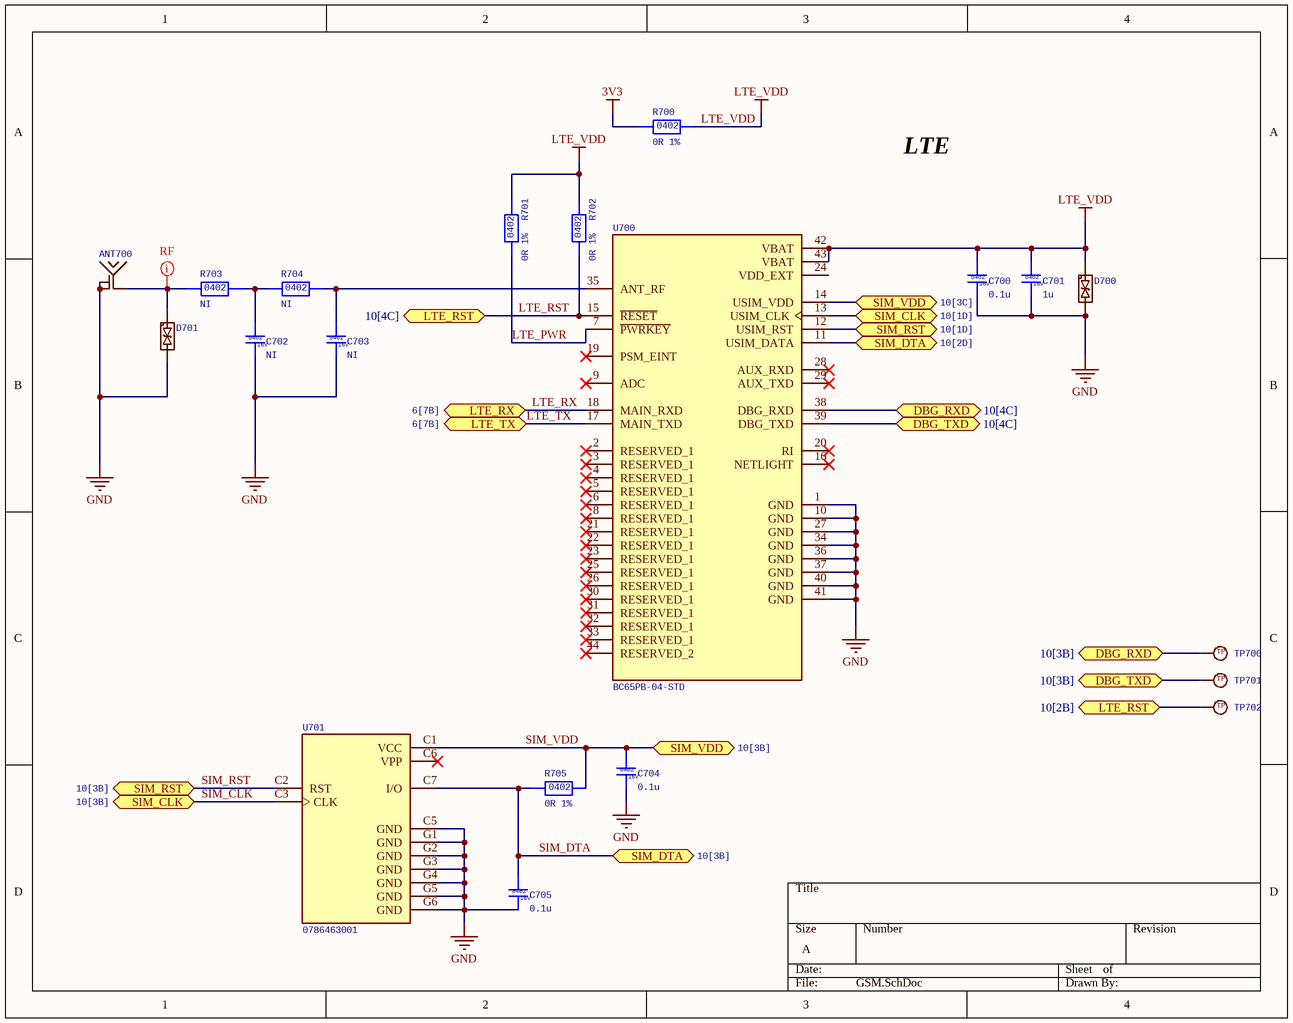
[diagram p10: GSM.SchDoc]

### Parts
ANT700  2337019-1  [2337019-1]  (value not drawn)
C700  0.1u  [CAP0402]
C701  1u  [CAP0402]
C702  NI  [CAP0402]
C703  NI  [CAP0402]
C704  0.1u  [CAP0402]
C705  0.1u  [CAP0402]
D700  DESD3V3S1BL-7B  [DESD3V3S1BL-7B]  (value not drawn)
D701  DESD3V3S1BL-7B  [DESD3V3S1BL-7B]  (value not drawn)
R700  0R 1%  [RES0402]
R701  0R 1%  [RES0402]
R702  0R 1%  [RES0402]
R703  NI  [RES0402]
R704  NI  [RES0402]
R705  0R 1%  [RES0402]
TP700  TP  [TP]  (value not drawn)
TP701  TP  [TP]  (value not drawn)
TP702  TP  [TP]  (value not drawn)
U700  BC65PB-04-STD  [BC65PB-04-STD]
U701  0786463001  [0786463001]

### Ports
DBG_RXD (bidir, see 10[3B]), DBG_RXD (bidir, see 10[4C]), DBG_TXD (bidir, see 10[3B]), DBG_TXD (bidir, see 10[4C]), LTE_RST (bidir, see 10[2B]), LTE_RST (bidir, see 10[4C]), LTE_RX (bidir, see 6[7B]), LTE_TX (bidir, see 6[7B]), SIM_CLK (bidir, see 10[1D]), SIM_CLK (bidir, see 10[3B]), SIM_DTA (bidir, see 10[2D]), SIM_DTA (bidir, see 10[3B]), SIM_RST (bidir, see 10[1D]), SIM_RST (bidir, see 10[3B]), SIM_VDD (bidir, see 10[3B]), SIM_VDD (bidir, see 10[3C])

### Nets
3V3: R700.1
GND: ANT700.G1(GND) ANT700.G2(GND) C700.2 C701.2 C702.2 C703.2 C704.2 C705.2 D700.2 D701.2 U700.1(GND) U700.10(GND) U700.27(GND) U700.34(GND) U700.36(GND) U700.37(GND) U700.40(GND) U700.41(GND) U701.C5(GND) U701.G1(GND) U701.G2(GND) U701.G3(GND) U701.G4(GND) U701.G5(GND) U701.G6(GND)
LTE_VDD: C700.1 C701.1 D700.1 R700.2 R701.2 R702.2 U700.42(VBAT) U700.43(VBAT)
LTE_PWR: R701.1 U700.7(~{PWRKEY})
LTE_RST: R702.1 TP702.1 U700.15(~{RESET}) ; port LTE_RST
LTE_RX: U700.18(MAIN_RXD) ; port LTE_RX
LTE_TX: U700.17(MAIN_TXD) ; port LTE_TX
SIM_CLK: U700.13(USIM_CLK) U701.C3(CLK) ; port SIM_CLK
SIM_DTA: C705.1 R705.1 U700.11(USIM_DATA) U701.C7(I/O) ; port SIM_DTA
SIM_RST: U700.12(USIM_RST) U701.C2(RST) ; port SIM_RST
SIM_VDD: C704.1 R705.2 U700.14(USIM_VDD) U701.C1(VCC) ; port SIM_VDD
NetANT700_1: ANT700.1 D701.1 R703.1
NetC702_1: C702.1 R703.2 R704.1
NetC703_1: C703.1 R704.2 U700.35(ANT_RF)
NetTP700_1: TP700.1 U700.38(DBG_RXD) ; port DBG_RXD
NetTP701_1: TP701.1 U700.39(DBG_TXD) ; port DBG_TXD

Not connected (* = marked no-connect by the designer): U700 2(RESERVED_1)* 3(RESERVED_1)* 4(RESERVED_1)* 5(RESERVED_1)* 6(RESERVED_1)* 8(RESERVED_1)* 9(ADC)* 16(NETLIGHT)* 19(PSM_EINT)* 20(RI)* 21(RESERVED_1)* 22(RESERVED_1)* 23(RESERVED_1)* 24(VDD_EXT) 25(RESERVED_1)* 26(RESERVED_1)* 28(AUX_RXD)* 29(AUX_TXD)* 30(RESERVED_1)* 31(RESERVED_1)* 32(RESERVED_1)* 33(RESERVED_1)* 44(RESERVED_2)*; U701 C6(VPP)*

### Layout directives
mark named RF: NetANT700_1

### Notes on the sheet
- LTE

### Library data of the parts
ANT700 = 2337019-1: UMCC MICRO-COAX RECEPTACLE, GEN; Supplier 1: Digikey; Supplier Part Number 1: A144746CT-ND
C700 C702-C705 = C_0402_0.1u: as C200 on sheet MCU; Supplier: Digikey; Supplier Part Number: 490-6328-1-ND; RoHS: Yes; Category: Ceramic Capacitors; Stock: 19409569; Pricing: 1=0.1, 10=0.019, 50=0.011, 100=0.0086, 500=0.00646, 1000=0.00508, 2500=0.00462, 5000=0.00425 (USD); Mounting Technology: Surface Mount; Pins: 2; Dielectric Material: Ceramic; Package Shape: Rectangular; Case/Package: 0402; Terminal Finish: Nickel; Min Operating Temperature: -55°C; Max Operating Temperature: 125°C; JESD-609 Code: e3; Capacitor Type: Ceramic; Tolerance  (fill in as +-): 10%; Package Style: SMTMeter; Packaging: Tape and Reel; Tolerance (fill in as +-): 10%; Rated DC Voltage (URdc): 16V; Temperature Characteristics Code: X7R; Termination: Wraparound; Length: 1mm; Width: 0.5mm; Height: 0.5mm; Reach SVHC Compliant: Yes; RoHS Compliant: Yes; ComponentLink1URL: https://psearch.en.murata.com:443/capacitor/product/GRM155R71C104KA88%23.pdf?src-supplier=IHS+Markit; ComponentLink1Description: https://psearch.en.murata.com:443/capacitor/product/GRM155R71C104KA88%23.pdf?src-supplier=IHS+Markit; ComponentLink2URL: https://datasheet.ciiva.com/6271/product-6271168.pdf?src-supplier=Digikey; ComponentLink2Description: https://datasheet.ciiva.com/6271/product-6271168.pdf?src-supplier=Digikey; ComponentLink3URL: https://datasheet.ciiva.com/6271/grm155r71c104ka88-01-6271231.pdf?src-supplier=Digikey; ComponentLink3Description: https://datasheet.ciiva.com/6271/grm155r71c104ka88-01-6271231.pdf?src-supplier=Digikey
C701 = C_0402_1u: as C203 on sheet MCU; Supplier: Digikey; Supplier Part Number: 587-2477-1-ND; RoHS: Yes; Category: Ceramic Capacitors; Stock: 2709915; Pricing: 1=0.1, 10=0.045, 50=0.031, 100=0.0266, 500=0.01912, 1000=0.01682, 2500=0.01437, 5000=0.01289 (USD); Mounting Technology: Surface Mount; Pins: 2; Dielectric Material: Ceramic; Package Shape: Rectangular; Case/Package: 0402; Terminal Finish: Nickel; Min Operating Temperature: -55°C; Max Operating Temperature: 85°C; JESD-609 Code: e3; Value: 1uF; Capacitor Type: Ceramic; Tolerance  (fill in as +-): 10%; Package Style: SMTMeter; Packaging: Tape and Reel; Tolerance (fill in as +-): 10%; Rated DC Voltage (URdc): 16V; Temperature Characteristics Code: X5R; Termination: Wraparound; Length: 1mm; Width: 0.5mm; Height: 0.5mm; Reach SVHC Compliant: Yes; RoHS Compliant: Yes; ComponentLink1URL: https://datasheet.ciiva.com:443/pdfs/VipMasterIC/IC/TAIY/TAIY-S-A0009096450/TAIY-S-A0009096597-1.pdf?src-supplier=IHS+Markit; ComponentLink1Description: https://datasheet.ciiva.com:443/pdfs/VipMasterIC/IC/TAIY/TAIY-S-A0009096450/TAIY-S-A0009096597-1.pdf?src-supplier=IHS+Markit; ComponentLink2URL: https://datasheet.ciiva.com/134/emk105bj105kv-f-ss-134209.pdf?src-supplier=Digikey; ComponentLink2Description: https://datasheet.ciiva.com/134/emk105bj105kv-f-ss-134209.pdf?src-supplier=Digikey; ComponentLink3URL: https://datasheet.ciiva.com/15920/964emk105bj105kv-f-15920402.pdf?src-supplier=Onlinecomponents.com; ComponentLink3Description: https://datasheet.ciiva.com/15920/964emk105bj105kv-f-15920402.pdf?src-supplier=Onlinecomponents.com; ComponentLink4URL: https://datasheet.ciiva.com/26871/getdatasheetpartid-638287-26871289.pdf?src-supplier=Verical; ComponentLink4Description: https://datasheet.ciiva.com/26871/getdatasheetpartid-638287-26871289.pdf?src-supplier=Verical; ComponentLink5URL: https://datasheet.ciiva.com/30259/265emk105bj105kv-f-30259872.pdf?src-supplier=Onlinecomponents.com; ComponentLink5Description: https://datasheet.ciiva.com/30259/265emk105bj105kv-f-30259872.pdf?src-supplier=Onlinecomponents.com; ComponentLink6URL: https://datasheet.ciiva.com/7657/1497285-7657320.pdf?src-supplier=Element14; ComponentLink6Description: https://datasheet.ciiva.com/7657/1497285-7657320.pdf?src-supplier=Element14; ComponentLink7URL: https://datasheet.ciiva.com/22694/1497285-22694239.pdf?src-supplier=Element14; ComponentLink7Description: https://datasheet.ciiva.com/22694/1497285-22694239.pdf?src-supplier=Element14; ComponentLink8URL: https://datasheet.ciiva.com/5424/mlcc01-e-5424190.pdf?src-supplier=Mouser; ComponentLink8Description: https://datasheet.ciiva.com/5424/mlcc01-e-5424190.pdf?src-supplier=Mouser
D700 D701 = DESD3V3S1BL-7B: Trans Voltage Suppressor Diode, 35W, 3.3V V(RWM), Bidirectional, 1 Element, Silicon; Manufacturer: Diodes; Package Body Material: Plastic; Max Breakdown Voltage: 6.5V; Min Breakdown Voltage: 3.8V; Number of Elements: 1; Max Power Dissipation: 250mW; Supplier 1: Digikey; Supplier Part Number 1: DESD3V3S1BL-7BDICT-ND; Supplier: Digikey; Supplier Part Number: DESD3V3S1BL-7BDICT-ND; Manufacturer Part Number: DESD3V3S1BL-7B; RoHS: Yes; Category: TVS Diodes; Stock: 1369752; Pricing: 1=0.22, 10=0.148, 100=0.0722, 500=0.0602, 1000=0.04182, 2000=0.03625, 5000=0.03362, 10000=0.0302, 20000=0.02888 (USD); Pins: 2; Diode Element Material: SILICON; Package Shape: Rectangular; Terminal Finish: Nickel; Min Operating Temperature: -65°C; Max Operating Temperature: 150°C; JESD-609 Code: e4; Polarity: Bidirectional; Diode Type: TRANS VOLTAGE SUPPRESSOR; Moisture Sensitivity Level: 1; Non-rep Peak Rev Power Dis-Max: 35W; Package Style: CHIP CARRIERMeter; Rep Pk Reverse Voltage-Max: 3.3V; Surface Mount: Yes; Technology: AVALANCHE; Terminal Form: No Lead; Terminal Position: BOTTOM; Reach SVHC Compliant: Yes; RoHS Compliant: Yes; ComponentLink1URL: https://datasheet.ciiva.com:443/pdfs/VipMasterIC/IC/DIOD/DIOD-S-A0005045876/DIOD-S-A0005045876-1.pdf?src-supplier=IHS+Markit; ComponentLink1Description: https://datasheet.ciiva.com:443/pdfs/VipMasterIC/IC/DIOD/DIOD-S-A0005045876/DIOD-S-A0005045876-1.pdf?src-supplier=IHS+Markit; ComponentLink2URL: https://datasheet.ciiva.com/48480/desd3v3s1bl-48480026.pdf?src-supplier=Avnet; ComponentLink2Description: https://datasheet.ciiva.com/48480/desd3v3s1bl-48480026.pdf?src-supplier=Avnet
R700-R702 R705 = R_0402_0R: as R200 on sheet MCU; Supplier 1: Digikey; Supplier Part Number 1: 311-0.0JRTR-ND; Supplier: Digikey; Supplier Part Number: 311-0.0JRCT-ND; RoHS: Yes; Category: Chip SMD Resistors; Stock: 14877447; Pricing: 1=0.1, 10=0.011, 25=0.0084, 50=0.0064, 100=0.0045, 250=0.00364, 500=0.0029, 1000=0.00214, 5000=0.00154, 10000=0.00133, 30000=0.00117, 50000=0.00107, 100000=0.00105 (USD); Mounting Technology: Surface Mount; Pins: 2; Package Shape: Rectangular; Case/Package: 0402; Terminal Finish: Nickel; Min Operating Temperature: -55°C; Max Operating Temperature: 155°C; JESD-609 Code: e3; Resistor Type: FIXED RESISTOR; Packaging: Tape and Reel; Value: 0R; Technology: METAL GLAZE/THICK FILM; Termination: Wraparound; Construction: Chip; Package Style: SMTMeter; Reach SVHC Compliant: Yes; RoHS Compliant: Yes; ComponentLink1URL: https://datasheet.ciiva.com:443/pdfs/VipMasterIC/IC/YAGO/YAGO-S-A0008145938/YAGO-S-A0008145938-1.pdf?src-supplier=IHS+Markit; ComponentLink1Description: https://datasheet.ciiva.com:443/pdfs/VipMasterIC/IC/YAGO/YAGO-S-A0008145938/YAGO-S-A0008145938-1.pdf?src-supplier=IHS+Markit; ComponentLink2URL: https://datasheet.ciiva.com/2452/pyu-rc0402-51-rohs-l-6-2452608.pdf?src-supplier=Digikey; ComponentLink2Description: https://datasheet.ciiva.com/2452/pyu-rc0402-51-rohs-l-6-2452608.pdf?src-supplier=Digikey; ComponentLink3URL: https://datasheet.ciiva.com/11808/0900766b80c66297-11808195.pdf?src-supplier=Rs; ComponentLink3Description: https://datasheet.ciiva.com/11808/0900766b80c66297-11808195.pdf?src-supplier=Rs; ComponentLink4URL: https://datasheet.ciiva.com/7983/1018594-7983535.pdf?src-supplier=Element14; ComponentLink4Description: https://datasheet.ciiva.com/7983/1018594-7983535.pdf?src-supplier=Element14; ComponentLink5URL: https://datasheet.ciiva.com/22747/1018594-22747515.pdf?src-supplier=Element14; ComponentLink5Description: https://datasheet.ciiva.com/22747/1018594-22747515.pdf?src-supplier=Element14; ComponentLink6URL: https://datasheet.ciiva.com/2452/pyu-r-int-thick-7-2452609.pdf?src-supplier=Digikey; ComponentLink6Description: https://datasheet.ciiva.com/2452/pyu-r-int-thick-7-2452609.pdf?src-supplier=Digikey; ComponentLink7URL: https://datasheet.ciiva.com/2452/pyu-r-int-thick-7-2452610.pdf?src-supplier=Digikey; ComponentLink7Description: https://datasheet.ciiva.com/2452/pyu-r-int-thick-7-2452610.pdf?src-supplier=Digikey; ComponentLink8URL: https://datasheet.ciiva.com/8896/pyu-rc0402-51-rohs-l-6-8896201.pdf?src-supplier=Avnet; ComponentLink8Description: https://datasheet.ciiva.com/8896/pyu-rc0402-51-rohs-l-6-8896201.pdf?src-supplier=Avnet
R703 R704 = R_0402_0R: Metal Glaze/thick Film, 0.0625W, 0ohm, Surface Mount, 0402; Manufacturer: Yageo; Manufacturer Part Number: RC0402JR-070RL; Power: 62.5mW; Rated Temperature: 70°C; Value: 0R; Package Height: 0.35mm; Package Length: 1mm; Package Width: 0.5mm; Supplier 1: Digikey; Supplier Part Number 1: 311-0.0JRTR-ND; Supplier: Digikey; Supplier Part Number: 311-0.0JRCT-ND; RoHS: Yes; Category: Chip SMD Resistors; Stock: 14877447; Pricing: 1=0.1, 10=0.011, 25=0.0084, 50=0.0064, 100=0.0045, 250=0.00364, 500=0.0029, 1000=0.00214, 5000=0.00154, 10000=0.00133, 30000=0.00117, 50000=0.00107, 100000=0.00105 (USD); Mounting Technology: Surface Mount; Pins: 2; Package Shape: Rectangular; Case/Package: 0402; Terminal Finish: Nickel; Min Operating Temperature: -55°C; Max Operating Temperature: 155°C; JESD-609 Code: e3; Resistor Type: FIXED RESISTOR; Packaging: Tape and Reel; Technology: METAL GLAZE/THICK FILM; Termination: Wraparound; Construction: Chip; Package Style: SMTMeter; Reach SVHC Compliant: Yes; RoHS Compliant: Yes; ComponentLink1URL: https://datasheet.ciiva.com:443/pdfs/VipMasterIC/IC/YAGO/YAGO-S-A0008145938/YAGO-S-A0008145938-1.pdf?src-supplier=IHS+Markit; ComponentLink1Description: https://datasheet.ciiva.com:443/pdfs/VipMasterIC/IC/YAGO/YAGO-S-A0008145938/YAGO-S-A0008145938-1.pdf?src-supplier=IHS+Markit; ComponentLink2URL: https://datasheet.ciiva.com/2452/pyu-rc0402-51-rohs-l-6-2452608.pdf?src-supplier=Digikey; ComponentLink2Description: https://datasheet.ciiva.com/2452/pyu-rc0402-51-rohs-l-6-2452608.pdf?src-supplier=Digikey; ComponentLink3URL: https://datasheet.ciiva.com/11808/0900766b80c66297-11808195.pdf?src-supplier=Rs; ComponentLink3Description: https://datasheet.ciiva.com/11808/0900766b80c66297-11808195.pdf?src-supplier=Rs; ComponentLink4URL: https://datasheet.ciiva.com/7983/1018594-7983535.pdf?src-supplier=Element14; ComponentLink4Description: https://datasheet.ciiva.com/7983/1018594-7983535.pdf?src-supplier=Element14; ComponentLink5URL: https://datasheet.ciiva.com/22747/1018594-22747515.pdf?src-supplier=Element14; ComponentLink5Description: https://datasheet.ciiva.com/22747/1018594-22747515.pdf?src-supplier=Element14; ComponentLink6URL: https://datasheet.ciiva.com/2452/pyu-r-int-thick-7-2452609.pdf?src-supplier=Digikey; ComponentLink6Description: https://datasheet.ciiva.com/2452/pyu-r-int-thick-7-2452609.pdf?src-supplier=Digikey; ComponentLink7URL: https://datasheet.ciiva.com/2452/pyu-r-int-thick-7-2452610.pdf?src-supplier=Digikey; ComponentLink7Description: https://datasheet.ciiva.com/2452/pyu-r-int-thick-7-2452610.pdf?src-supplier=Digikey; ComponentLink8URL: https://datasheet.ciiva.com/8896/pyu-rc0402-51-rohs-l-6-8896201.pdf?src-supplier=Avnet; ComponentLink8Description: https://datasheet.ciiva.com/8896/pyu-rc0402-51-rohs-l-6-8896201.pdf?src-supplier=Avnet
TP700-TP702 = TP: Test Point
U700 = BC65PB-04-STD: Compact NB-IoT Module with Ultra-low Power Consumption for Quectel GSM/GPRS M66/NB-IoT BC66/BC66-NA/BC68 LCC; Manufacturer: Quectel Wireless Solutions; Supplier: Digikey; Supplier Part Number: 2958-BC65PB-04-STDCT-ND; Manufacturer Part Number: BC65PB-04-STD; RoHS: No; Stock: 1260; Pricing: 1=8.4, 10=7.7, 25=7, 100=6.3 (USD); ComponentLink1URL: https://datasheet.octopart.com/BC65PB-04-STD-Quectel-datasheet-163886004.pdf?src-supplier=SOS+electronic; ComponentLink1Description: https://datasheet.octopart.com/BC65PB-04-STD-Quectel-datasheet-163886004.pdf?src-supplier=SOS+electronic; Supplier 1: Digikey; Supplier Part Number 1: 2958-BC65PB-04-STDCT-ND
U701 = 0786463001: PCB Connector; Manufacturer: Molex; Manufacturer Series: 78646; Supplier: Digikey; Supplier Part Number: WM9364CT-ND; Manufacturer Part Number: 0786463001; RoHS: Yes; Stock: 215355; Pricing: 1=0.89, 10=0.737, 100=0.6142 (USD); Contact Finish - Mating: NOT SPECIFIED; Connector Type: PCB; Reach SVHC Compliant: Yes; RoHS Compliant: Yes; ComponentLink1URL: https://datasheet.ciiva.com:443/pdfs/VipMasterIC/IC/MOLE/MOLE-S-A0006767587/MOLE-S-A0006867848-1.pdf?src-supplier=IHS+Markit; ComponentLink1Description: https://datasheet.ciiva.com:443/pdfs/VipMasterIC/IC/MOLE/MOLE-S-A0006767587/MOLE-S-A0006867848-1.pdf?src-supplier=IHS+Markit; Supplier 1: Digikey; Supplier Part Number 1: WM9364CT-ND

## Sheet Sheet1.SchDoc
size A3; SheetNumber: 12; SheetTotal: 12
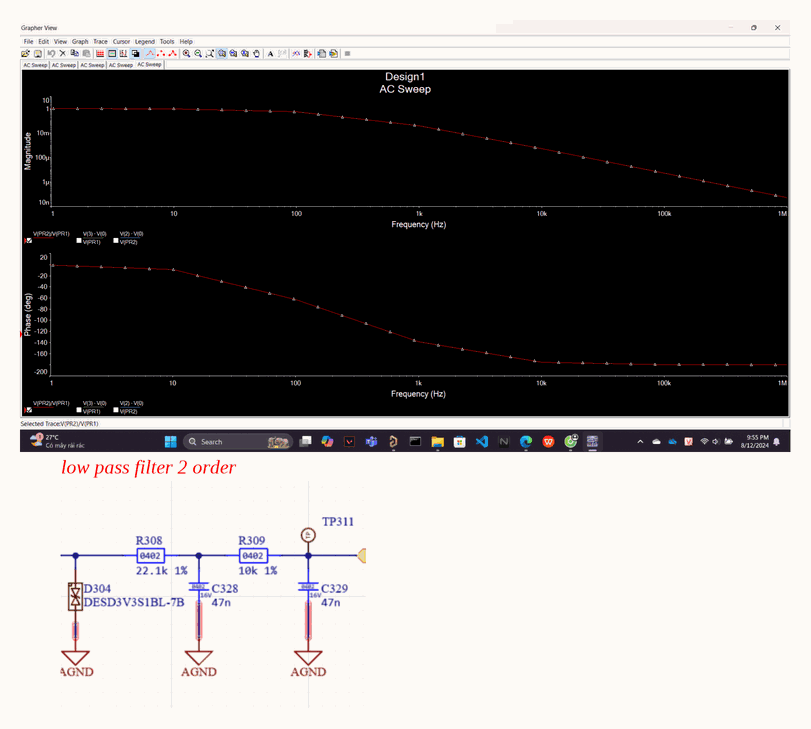
[diagram p11: Sheet1.SchDoc]

### Notes on the sheet
- low pass filter 2 order

## Nets that join several sheets
3V3: IMU (R500.1), SOURCE_POWER (6 pins), GPS (R600.1), BIO_SENSOR (R301.1 R302.1), MCU (R200.1), GSM (R700.1)
GND: IMU (9 pins), SOURCE_POWER (41 pins), GPS (10 pins), BIO_SENSOR (R303.1), INTERFACE (C800.2 C801.2 C802.2 U800.4), MCU (40 pins), GSM (25 pins)
VBAT: SOURCE_POWER (12 pins), INTERFACE (5 pins)
LTE_RX: MCU (U200.C4), GSM (U700.18)
LTE_TX: MCU (U200.C6), GSM (U700.17)
NetR313_1: BIO_SENSOR (R313.1 U300.D6), MCU (U200.H2)
P0.02: BIO_SENSOR (R312.1 U300.F7), MCU (U200.G11)
P0.03: BIO_SENSOR (U300.F3), MCU (U200.H12)
P0.08: BIO_SENSOR (U300.H8), MCU (U200.L12)
P0.10: IMU (U500.9), MCU (U200.J8)
P0.12: IMU (R505.2 U500.4), MCU (U200.J6)
P0.22: BIO_SENSOR (U300.F5), MCU (U200.K4)
P0.24: BIO_SENSOR (U300.E8), MCU (U200.K2)
P0.25: BIO_SENSOR (U300.E5), MCU (U200.L1)
P0.26: BIO_SENSOR (U300.E7), MCU (U200.J2)
P0.27: BIO_SENSOR (U300.E3), MCU (U200.H1)
P0.28: SOURCE_POWER (R104.1 R109.2), MCU (U200.E3)
P1.02: IMU (U500.14), SOURCE_POWER (R115.1), GPS (U600.16), INTERFACE (U800.5), MCU (R201.1 U200.J11)
P1.03: IMU (U500.13), SOURCE_POWER (R114.1), GPS (U600.17), INTERFACE (U800.6), MCU (R202.1 U200.K12)
P1.05: BIO_SENSOR (U300.F8), MCU (U200.L3)
P1.06: BIO_SENSOR (U300.E6), MCU (U200.J3)

## Assembly variants
Med_Prj_ECG_V1.0_Prototype: not fitted R113 R127 R128 R311 R335 R338 R339 R503